# Altium schematic sheet Debug Interface.SchDoc: Debug Interface
size A4; SheetNumber: 10
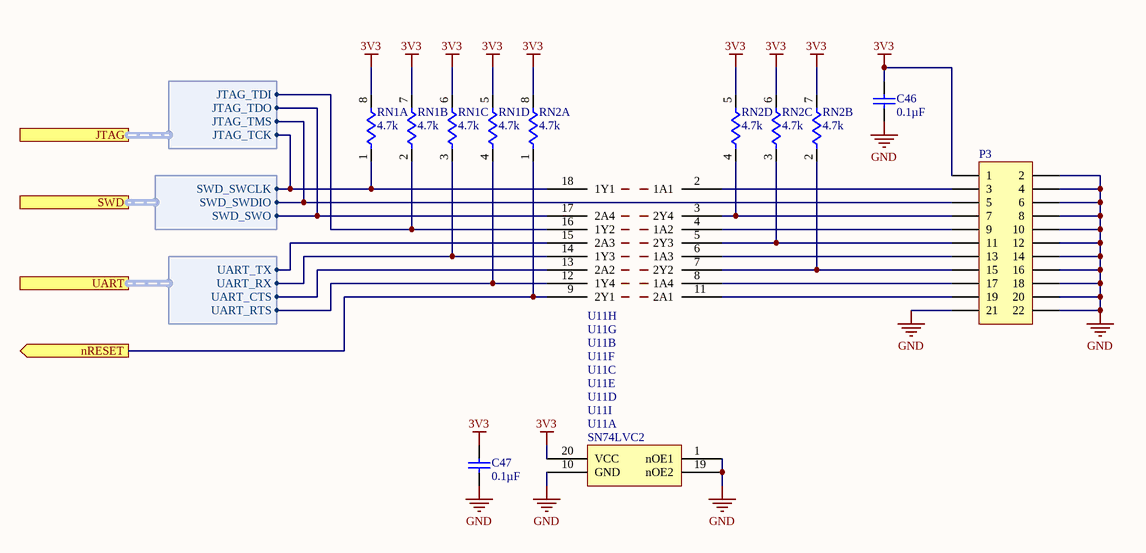
[diagram p0: Debug Interface.SchDoc]

## Parts
C46  value 0.1µF  [TDK-CGA2B]  (hidden comment: Cap)
C47  value 0.1µF  [TDK-CGA2B]  (hidden comment: Cap)
P3  G125-MH12005L1P  [HWN-G125-MH12005L1P]  (value not drawn)
RN1  value 4.7k  [PANA-EXB28V]  (hidden comment: Res4 Pack1)  (parts A,B,C,D of 4)
RN2  value 4.7k  [PANA-EXB28V]  (hidden comment: Res4 Pack1)  (parts A,B,C,D of 4)
U11  SN74LVC2  [TI-PWRPDSOG20]  (parts A,B,C,D,E,F,G,H,I of 9)

## Ports
JTAG (harness DEBUG_JTAG), nRESET (out), SWD (harness DEBUG_SWD), UART (harness DEBUG_UART)

## Harnesses
DEBUG_SWD: SWD_SWCLK, SWD_SWDIO, SWD_SWO
DEBUG_JTAG: JTAG_TMS, JTAG_TCK, JTAG_TDO, JTAG_TDI
DEBUG_UART: UART_TX, UART_RX, UART_RTS, UART_CTS

## Nets
3V3: C46.1 C47.1 P3.1 RN1.5 RN1.6 RN1.7 RN1.8 RN2.5 RN2.6 RN2.7 RN2.8 U11.20(VCC)
GND: C46.2 C47.2 P3.2 P3.4 P3.6 P3.8 P3.10 P3.12 P3.14 P3.16 P3.18 P3.20 P3.21 P3.22 U11.1(nOE1) U11.10(GND) U11.19(nOE2)
nRESET: RN2.1 U11.9(2Y1) ; port nRESET
NetP3_3: P3.3 U11.2(1A1)
NetP3_5: P3.5 ; port SWD.SWD_SWDIO, port JTAG.JTAG_TMS
NetP3_7: P3.7 RN2.4 U11.3(2Y4)
NetP3_9: P3.9 U11.4(1A2)
NetP3_11: P3.11 RN2.3 U11.5(2Y3)
NetP3_13: P3.13 U11.6(1A3)
NetP3_15: P3.15 RN2.2 U11.7(2Y2)
NetP3_17: P3.17 U11.8(1A4)
NetP3_19: P3.19 U11.11(2A1)
NetRN1_1: RN1.1 U11.18(1Y1) ; port SWD.SWD_SWCLK, port JTAG.JTAG_TCK
NetRN1_2: RN1.2 U11.16(1Y2) ; port JTAG.JTAG_TDI
NetRN1_3: RN1.3 U11.14(1Y3) ; port UART.UART_RX
NetRN1_4: RN1.4 U11.12(1Y4) ; port UART.UART_RTS
NetU11_13: U11.13(2A2) ; port UART.UART_CTS
NetU11_15: U11.15(2A3) ; port UART.UART_TX
NetU11_17: U11.17(2A4) ; port SWD.SWD_SWO, port JTAG.JTAG_TDO

## Library data of the parts
C46 C47 = PC-TDK-02259: CAP CER 0.1UF 50V X7R 0402; Manufacturer Part Number: CGA2B3X7R1H104K050BB; Index: 2259; Designator: C?; Tolerance: ±10%; Published: 2016-03-16; LatestRevisionDate: 2016-03-16; LatestRevisionNote: ...; PackageReference: 0402 (1005 Metric); Publisher: AlbertaSat; PackageDescription: Radial Cap, Thru-Hole; 2 Leads; 0.3 in Pin Spacing; Part Number: PC-TDK-02259; Supplier Part Number 1: 445-6899-1-ND; Supplier 1: Digi-key; Supplier Link: http://www.digikey.ca/product-search/en?keywords=445-6899-1-ND; Voltage - Rated: 50V; Temperature Coefficient: X7R; Applications: Automotive
P3 = PP-HWN-00018: CONN HEADER R/A 20POS 1.25MM; Index: 18; Designator: P?; Voltage - Rated: 250V; LatestRevisionDate: 2019-01-07; LatestRevisionNote: ...; Publisher: AlbertaSat; Part Number: PP-HWN-00018; Manufacturer Part Number: G125-MH12005L1P; Supplier Part Number 1: 952-2699-ND; Supplier 1: Digi-key; Supplier Part Number 2: 855-G125-MH12005L1P; Supplier 2: Mouser; Published: 2019-01-07; PackageReference: HWN-G125-MH12005L1P; PackageDescription: CONN HEADER R/A 20POS 1.25MM; Supplier Link: http://www.digikey.ca/product-search/en?keywords=952-2699-ND
RN1 RN2 = 19961: RES ARRAY 4 RES 4.7K OHM 0804; Part Number: 19961; Manufacturer Part Number: EXB-28V472JX; Sim Note: Enter the Resistance value into parameter field.; Designator: RN?; Tolerance: ±5%; Power: 62.5mW; Temperature Coefficient: ±200ppm/°C; Code_JEDEC: MS-012-AC; Supplier Part Number 1: Y7472CT-ND; Supplier 1: Digi-Key; Supplier Link: http://www.digikey.ca/product-search/en?keywords=Y7472CT-ND; PackageReference: 0804, Convex, Long Side Terminals
U11 = 53: IC BUF NON-INVERT 3.6V 20TSSOP; Part Number: 53; Designator: U?; Voltage - Supply: 1.65 V ~ 3.6 V; Current - Output (Max): 24 mA; Supplier Part Number 2: 595-SN74LVC244APWR; Supplier 2: Mouser; Manufacturer Part Number: SN74LVC244APWR; Supplier Part Number 1: 296-1230-1-ND; Supplier 1: Digi-Key; Supplier Link: #https://www.digikey.ca/product-detail/en/texas-instruments/SN74LVC244APWR/296-1230-1-ND/276498#; PackageReference: 20-TSSOP (0.173", 4.40mm Width); Operating Temperature: -40°C ~ 125°C (TA)